# Altium schematic sheet STM32F334R8T6-Module.SchDoc
size B
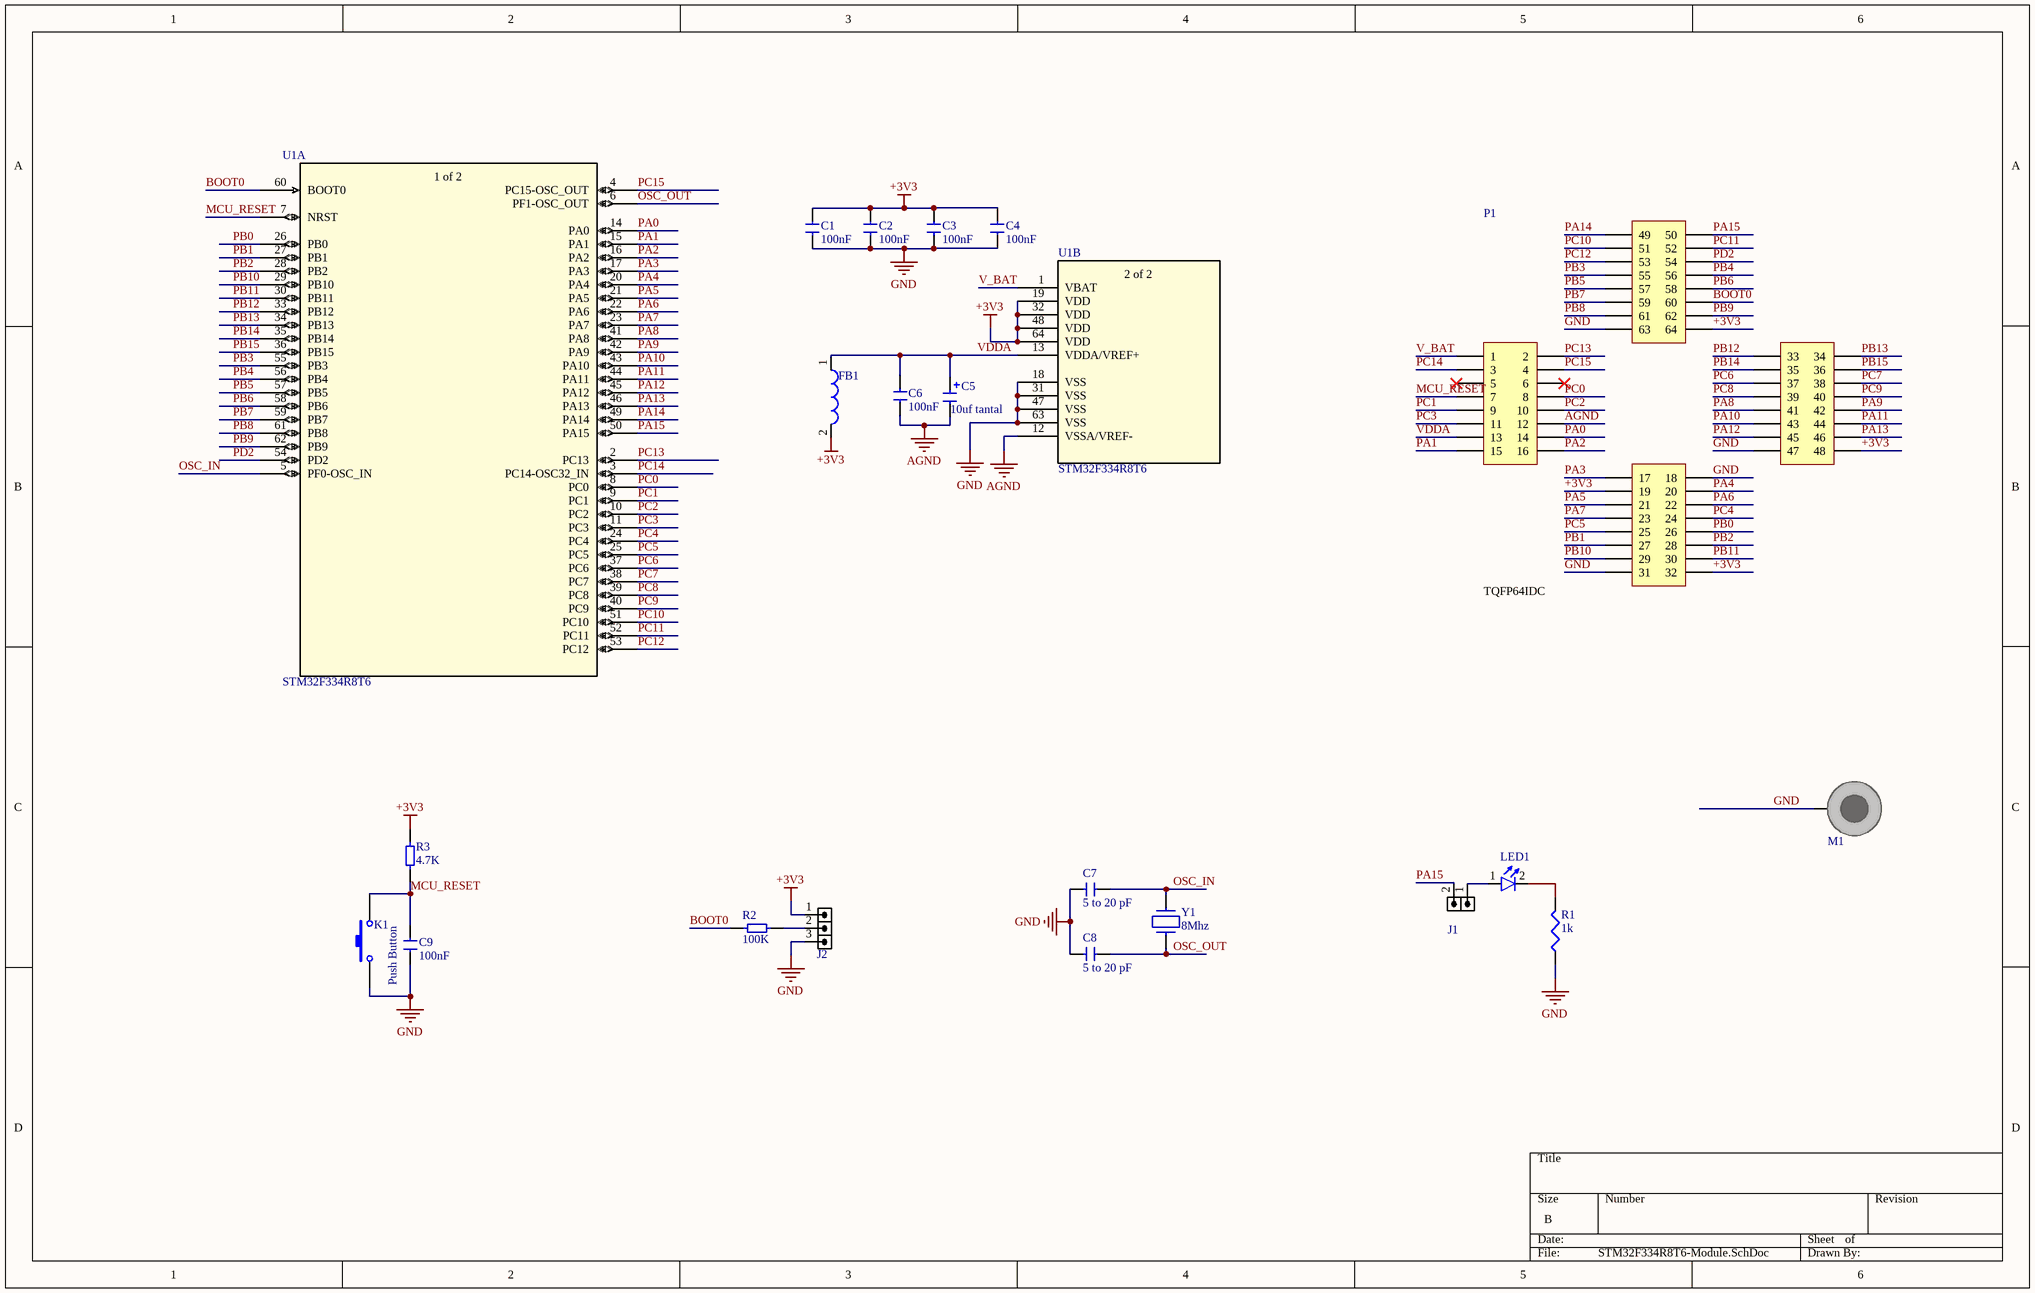
[diagram p0: STM32F334R8T6-Module.SchDoc]

## Parts
C1  Comment  [CAP 1206 (3216X15L)]  (value not drawn)
C2  Comment  [CAP 1206 (3216X15L)]  (value not drawn)
C3  Comment  [CAP 1206 (3216X15L)]  (value not drawn)
C4  Comment  [CAP 1206 (3216X15L)]  (value not drawn)
C5  10uf tantal  [cap-e-2]
C6  Comment  [CAP 1206 (3216X15L)]  (value not drawn)
C7  Comment  [CAP 1206 (3216X15L)]  (value not drawn)
C8  Comment  [CAP 1206 (3216X15L)]  (value not drawn)
C9  Comment  [CAP 1206 (3216X15L)]  (value not drawn)
FB1  Comment  [INDC4532]  (value not drawn)
J1  HDRM2  [HDR1X2]  (value not drawn)
J2  HDRM3  [HDR1X3]  (value not drawn)
K1  Push Button  [SW PB SMD]
LED1  HB  [LED SMD 1206]  (value not drawn)
M1  Comment  [Stud-hole]  (value not drawn)  (no BOM)
P1  TQFP64IDC  [tqfp64idc]
R1  1k  [RES 1206 (3216X08L)]
R2  Comment  [RES 1206 (3216X08L)]  (value not drawn)
R3  Comment  [RES 1206 (3216X08L)]  (value not drawn)
U1  STM32F334R8T6  [STM32F334R8T6]  (parts A,B of 2)
Y1  8Mhz  [Crystal SMD]

## Nets
+3V3: C1.2 C2.2 C3.2 C4.2 FB1.2 J2.1 P1.19 P1.32 P1.48 P1.64 R3.1 U1.19(VDD) U1.32(VDD) U1.48(VDD) U1.64(VDD)
AGND: C5.2 C6.1 P1.12 U1.12(VSSA/VREF-)
GND: C1.1 C2.1 C3.1 C4.1 C7.1 C8.2 C9.2 J2.3 K1.1 M1.1 P1.18 P1.31 P1.47 P1.63 R1.1 U1.18(VSS) U1.31(VSS) U1.47(VSS) U1.63(VSS)
BOOT0: P1.60 R2.1 U1.60(BOOT0)
MCU_RESET: C9.1 K1.2 P1.7 R3.2 U1.7(NRST)
OSC_IN: C7.2 U1.5(PF0-OSC_IN) Y1.2
OSC_OUT: C8.1 U1.6(PF1-OSC_OUT) Y1.1
PA0: P1.14 U1.14(PA0)
PA1: P1.15 U1.15(PA1)
PA2: P1.16 U1.16(PA2)
PA3: P1.17 U1.17(PA3)
PA4: P1.20 U1.20(PA4)
PA5: P1.21 U1.21(PA5)
PA6: P1.22 U1.22(PA6)
PA7: P1.23 U1.23(PA7)
PA8: P1.41 U1.41(PA8)
PA9: P1.42 U1.42(PA9)
PA10: P1.43 U1.43(PA10)
PA11: P1.44 U1.44(PA11)
PA12: P1.45 U1.45(PA12)
PA13: P1.46 U1.46(PA13)
PA14: P1.49 U1.49(PA14)
PA15: J1.2 P1.50 U1.50(PA15)
PB0: P1.26 U1.26(PB0)
PB1: P1.27 U1.27(PB1)
PB2: P1.28 U1.28(PB2)
PB3: P1.55 U1.55(PB3)
PB4: P1.56 U1.56(PB4)
PB5: P1.57 U1.57(PB5)
PB6: P1.58 U1.58(PB6)
PB7: P1.59 U1.59(PB7)
PB8: P1.61 U1.61(PB8)
PB9: P1.62 U1.62(PB9)
PB10: P1.29 U1.29(PB10)
PB11: P1.30 U1.30(PB11)
PB12: P1.33 U1.33(PB12)
PB13: P1.34 U1.34(PB13)
PB14: P1.35 U1.35(PB14)
PB15: P1.36 U1.36(PB15)
PC0: P1.8 U1.8(PC0)
PC1: P1.9 U1.9(PC1)
PC2: P1.10 U1.10(PC2)
PC3: P1.11 U1.11(PC3)
PC4: P1.24 U1.24(PC4)
PC5: P1.25 U1.25(PC5)
PC6: P1.37 U1.37(PC6)
PC7: P1.38 U1.38(PC7)
PC8: P1.39 U1.39(PC8)
PC9: P1.40 U1.40(PC9)
PC10: P1.51 U1.51(PC10)
PC11: P1.52 U1.52(PC11)
PC12: P1.53 U1.53(PC12)
PC13: P1.2 U1.2(PC13)
PC14: P1.3 U1.3(PC14-OSC32_IN)
PC15: P1.4 U1.4(PC15-OSC_OUT)
PD2: P1.54 U1.54(PD2)
V_BAT: P1.1 U1.1(VBAT)
VDDA: C5.1 C6.2 FB1.1 P1.13 U1.13(VDDA/VREF+)
NetJ1_1: J1.1 LED1.1(A)
NetJ2_2: J2.2 R2.2
NetLED1_2: LED1.2(K) R1.2

Not connected (* = marked no-connect by the designer): P1 5* 6*

## Notes on the sheet
- (in symbol Capacitor SMD) 100nF; 5 to 20 pF
- (in symbol Resistor SMD) 100K; 4.7K
- (in symbol STM32F334R8T6, part A) 1 of 2
- (in symbol STM32F334R8T6, part B) 2 of 2

## Library data of the parts
C1-C4 C6-C9 = Capacitor SMD
C5 = Capacitor Tantalium
FB1 = Ferrit Bead
J1 = HDR_M_1X2: CONN, HEADER, Male, pitch: 2.54mm, 2POS; VALUE: HDRM2
J2 = HDR_M_1X3: CONN, HEADER, Male, pitch: 2.54mm, 3POS; VALUE: HDRM3
K1 = Push Kay
LED1 = LED: Designer: Saeid Jorablo; Organazation: ControTec; Adding Date: 1387/12/22; Color: HB; Size: SMD 1206
M1 = SCMH_M1P6: SCREW mouting, M1.6, 1.6mm diameter and 3.2mm PanHead; VALUE: DNP/MH; ASSEMBLY: DNP
P1 = TQFP64IDC: system: Connector
R1 = R
R2 R3 = Resistor SMD
U1 = STM32F334R8T6: No Description Available; Mfr_Name: STMicroelectronics; Copyright: Copyright (C) 2023 Ultra Librarian. All rights reserved.; Manufacturer_Part_Number: STM32F334R8T6; RefDes: RefDes; Type: DEV
Y1 = Xtal